# Altium schematic sheet Encoders.SchDoc: Encoders
size A4 portrait; Organization: Use Organization_Name in ProjParam; Address1: Eliot Ferragni; Address2: STI-MOBOTS; Address3: EPFL; Address4: CH-1015 LAUSANNE; DocumentNumber: 7; Revision: A; SheetNumber: 7; SheetTotal: 7; ApprovedBy: Init ApprovedBy in DocParam; CheckedBy: Init CheckedBy in DocParam; Author: Init Author in DocParam; CompanyName: Init CompanyName in DocParam; DrawnBy: Init DrawBy in DocParam; Engineer: Init Engineer in DocParam; DocumentName: Init DocumentName in DocParam; ProjectName: Init ProjectName in DocParam
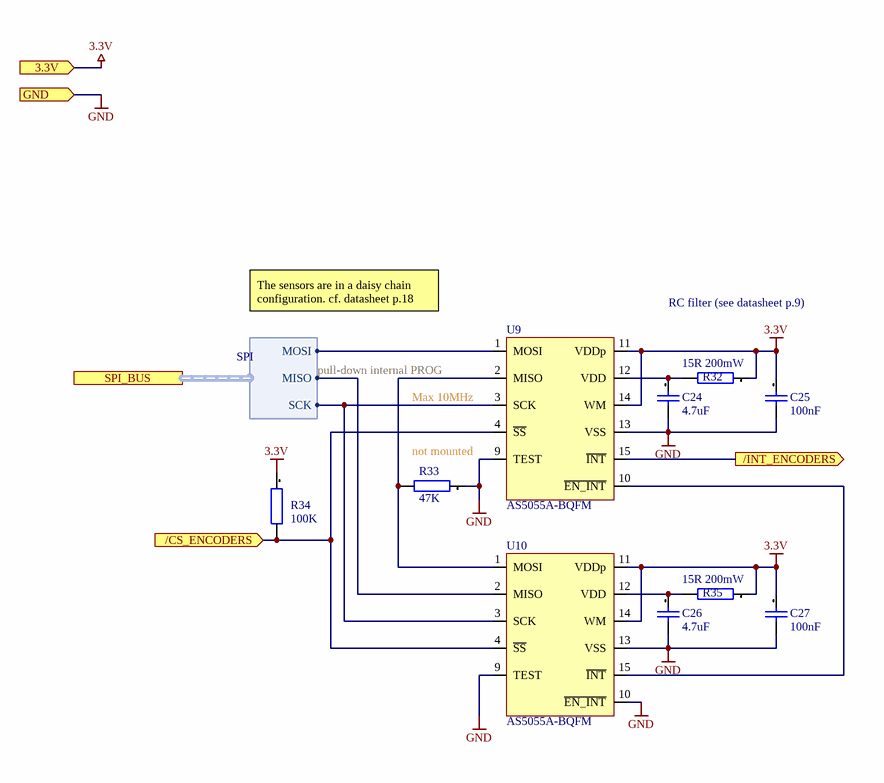
[diagram p0: Encoders.SchDoc]

## Parts
C24  4.7uF  [CAPC1608X08L]
C25  100nF  [CAPC1608X08L]
C26  4.7uF  [CAPC1608X08L]
C27  100nF  [CAPC1608X08L]
R32  15R 200mW  [RESC1608X06N]
R33  47K  [RESC1608X06N]
R34  100K  [RESC1608X06N]
R35  15R 200mW  [RESC1608X06N]
U9  AS5055A-BQFM  [QFN4X4-16 - EPAD unconnected]
U10  AS5055A-BQFM  [QFN4X4-16 - EPAD unconnected]

## Ports
3.3V (in), /CS_ENCODERS (in), /INT_ENCODERS (out), GND (in), SPI_BUS (harness SPI)

## Harnesses
SPI: MISO, MOSI, SCK

## Nets
3.3V: C25.1 C27.1 R32.1 R34.1 R35.1 U9.11(VDDp) U9.14(WM) U10.11(VDDp) U10.14(WM) ; port 3.3V
GND: C24.2 C25.2 C26.2 C27.2 R33.1 U9.9(TEST) U9.13(VSS) U10.9(TEST) U10.10(~{EN_INT}) U10.13(VSS) ; port GND
/CS_ENCODERS: R34.2 U9.4(~{SS}) U10.4(~{SS}) ; port /CS_ENCODERS
/INT_ENCODERS: U9.15(~{INT}) ; port /INT_ENCODERS
NetC24_1: C24.1 R32.2 U9.12(VDD)
NetC26_1: C26.1 R35.2 U10.12(VDD)
NetR33_2: R33.2 U9.2(MISO) U10.1(MOSI)
NetU9_1: U9.1(MOSI) ; port SPI_BUS.MOSI
NetU9_3: U9.3(SCK) U10.3(SCK) ; port SPI_BUS.SCK
NetU9_10: U9.10(~{EN_INT}) U10.15(~{INT})
NetU10_2: U10.2(MISO) ; port SPI_BUS.MISO

## Notes on the sheet
- The sensors are in a daisy chain configuration. cf. datasheet p.18
- RC filter (see datasheet p.9)
- (near U9) pull-down internal PROG
- (near U9) Max 10MHz
- not mounted
- Date:
- Project
- Part
- Revision:
- File :
- Page
- de

## Library data of the parts
C24-C27 = TBD Capacitor[[/\]]0603[[/\]]1: Capacitor TBD 0603; Preference: 1; Currentie: CHF; Size: 0603; Footprint Acort: 0603_G; ROHS: True; DateLastUpdate: 2012-11-19 / 14:36:40
R32-R35 = TBD[[/\]]0603[[/\]]1: Resistor ToDo 0603; Preference: 1; Currentie: CHF; Size: 0603; Footprint Acort: 0603; ROHS: True; DateLastUpdate: 2012-11-19 / 14:13:33
U9 U10 = AS5055A-BQFM: IC ENCODER ROTARY 12BIT 16QFN; Manufacturer: ams; Statut de la pièce: Actif; Pour la mesure: Angle; Technologie: Effet Hall; Angle de rotation - Électrique, mécanique: 0° ~ 360°, Modes continue; Sortie: SPI; Type d’actionneur: Aimant externe, non inclus; Linéarité: ±1,41°; Alimentation en tension: 3 V ~ 3,6 V; Type de montage: Montage en surface; Style de terminaison: Languette CMS (SMT); Température d’utilisation: -40°C ~ 85°C; Supplier 1: Digi-Key; RoHS: RoHS Compliant; Category: Capteurs, transducteurs; Stock 1: 6192; Pricing 1: 1=6.54, 10=5.885, 25=5.362, 100=4.8388, 250=4.44644 (EUR); Plage linéaire: -; Signal de sortie: -; Résistance (Ohms): -; Tolérance de résistance: -; ComponentLink1URL: http://ams.com/eng/content/download/552323/1541717/300455; ComponentLink1Description: http://ams.com/eng/content/download/552323/1541717/300455; Supplier 2: RSComponents; Manufacturer Part Number: AS5055A-BQFM; Supplier Part Number 1: AS5055A-BQFMCT-ND; Supplier Part Number 2: 423478